# EAGLE design synth-zodiac-taurus-cowbell (EAGLE 9.6.2)
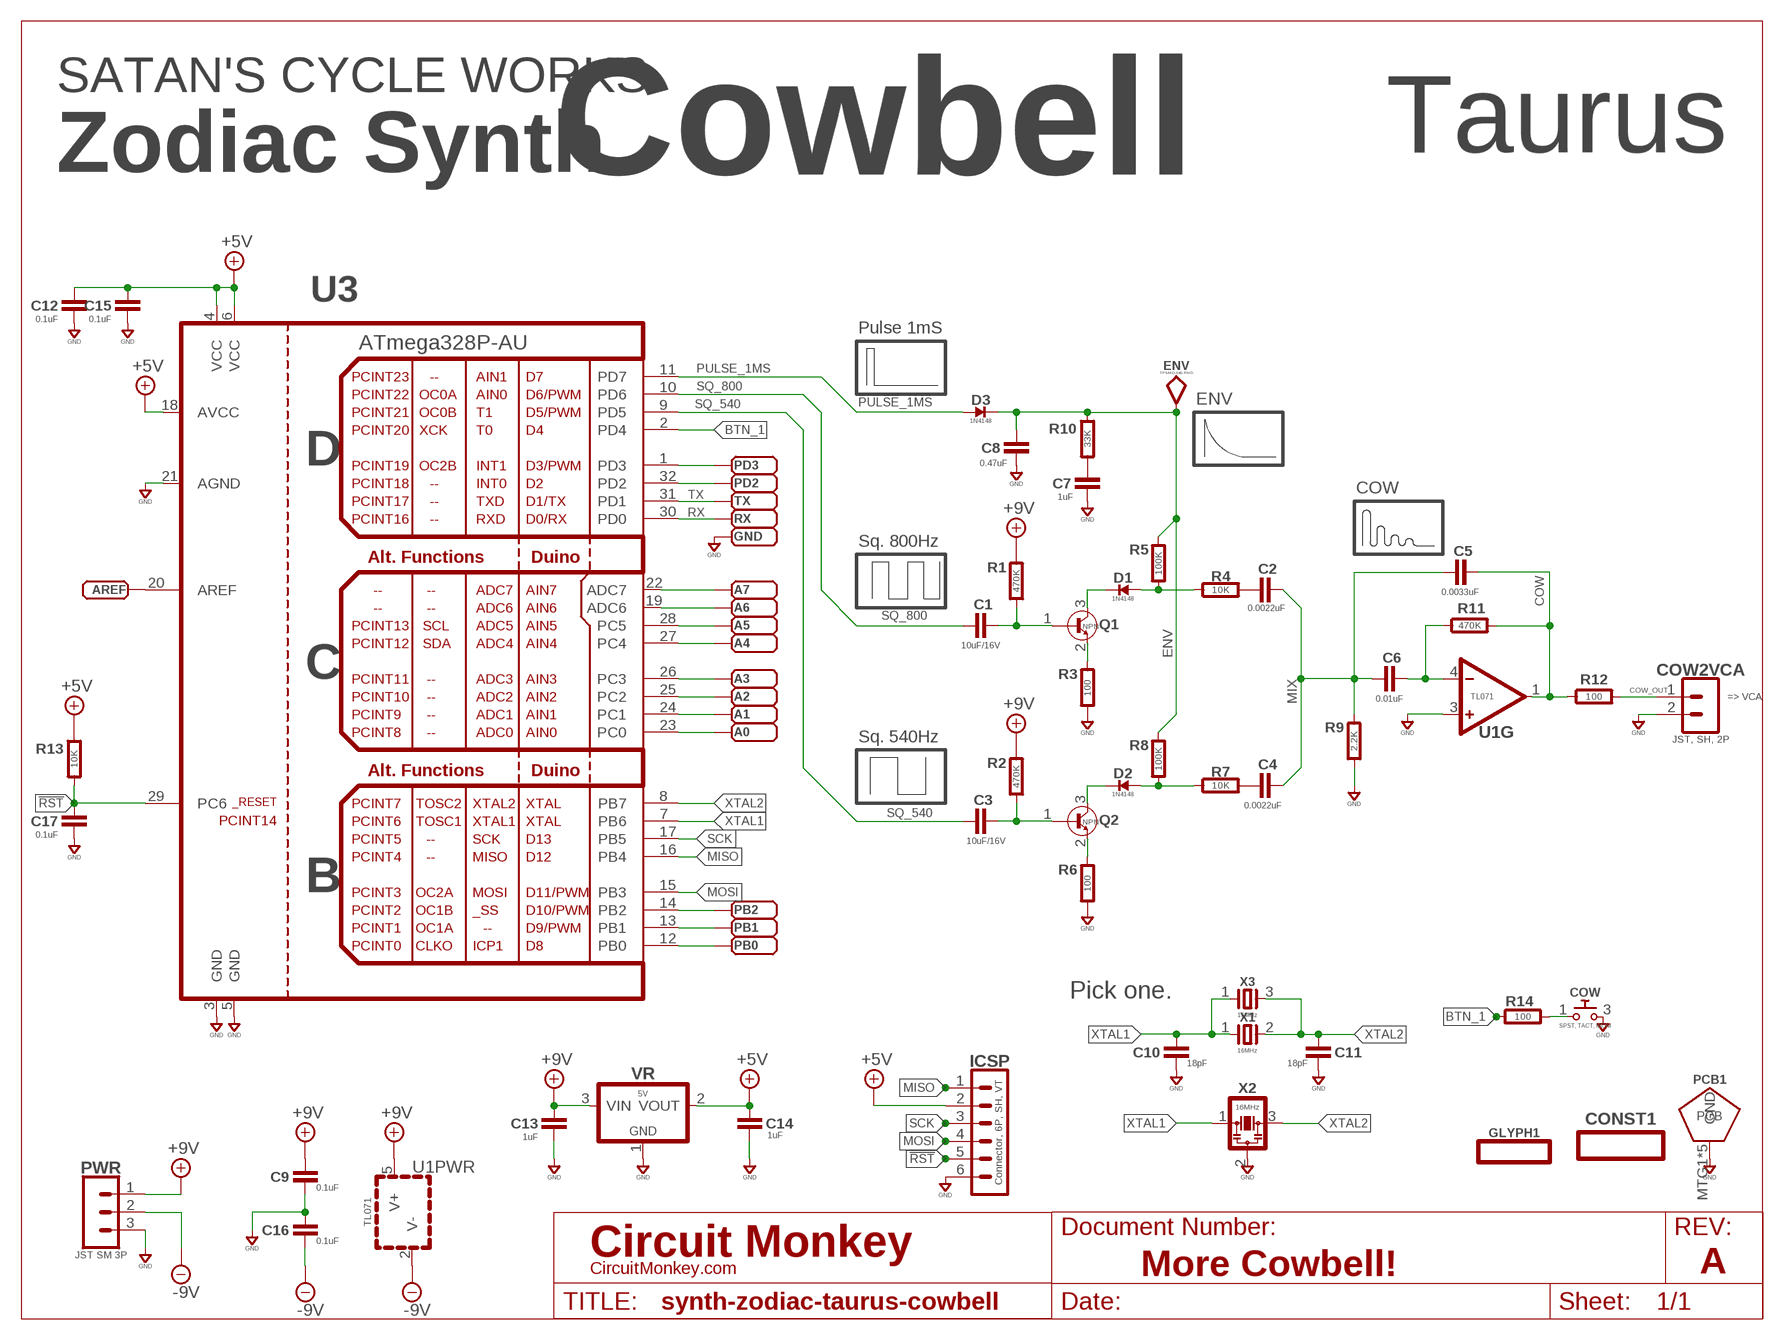
[diagram p0: schematic, sheet 1]
SHEET5 (LETTER_L-CIRCUITMONKEY): DOCUMENT_NUMBER: More Cowbell!; REV: A

## Parts
A0  PADSMD-050X050  [SMD-050X050]
A1  PADSMD-050X050  [SMD-050X050]
A2  PADSMD-050X050  [SMD-050X050]
A3  PADSMD-050X050  [SMD-050X050]
A4  PADSMD-050X050  [SMD-050X050]
A5  PADSMD-050X050  [SMD-050X050]
A6  PADSMD-050X050  [SMD-050X050]
A7  PADSMD-050X050  [SMD-050X050]
AREF  PADSMD-050X050  [SMD-050X050]
C1  10uF/16V  CAPACITOR0603  [0603-CAP]
C2  0.0022uF  CAPACITOR0603  [0603-CAP]
C3  10uF/16V  CAPACITOR0603  [0603-CAP]
C4  0.0022uF  CAPACITOR0603  [0603-CAP]
C5  0.0033uF  CAPACITOR0603  [0603-CAP]
C6  0.01uF  CAPACITOR0603  [0603-CAP]
C7  1uF  CAPACITOR0603  [0603-CAP]
C8  0.47uF  CAPACITOR0603  [0603-CAP]
C9  0.1uF  CAPACITOR0603  [0603-CAP]
C10  18pF  CAPACITOR0603  [0603-CAP]
C11  18pF  CAPACITOR0603  [0603-CAP]
C12  0.1uF  CAPACITOR0603  [0603-CAP]
C13  1uF  CAPACITOR0603  [0603-CAP]
C14  1uF  CAPACITOR0603  [0603-CAP]
C15  0.1uF  CAPACITOR0603  [0603-CAP]
C16  0.1uF  CAPACITOR0603  [0603-CAP]
C17  0.1uF  CAPACITOR0603  [0603-CAP]
CONST1  CONSTELLATION-TAURUS  [TAURUS-CONST]
COW  SPST, TACT, MOM  PUSHBTN-MOMB3FS-BLIND  [B3FS-BACKMOUNT]
COW2VCA  JST, SH, 2P  02P-SM-VT-SMT  [BM02B-SRSS-TB]
D1  1N4148  DIODE-1N4148  [SOD-123]
D2  1N4148  DIODE-1N4148  [SOD-123]
D3  1N4148  DIODE-1N4148  [SOD-123]
ENV  TPSMD-040-RND  [SMD-040MIL-RND]
GLYPH1  GLYPH-TAURUS  [TAURUS-GLYPH]
GND  PADSMD-050X050  [SMD-050X050]
ICSP  Connector, 6P, SH, VT  06P-SM-VT-SMT  [BM06B-SRSS-TB]
PB0  PADSMD-050X050  [SMD-050X050]
PB1  PADSMD-050X050  [SMD-050X050]
PB2  PADSMD-050X050  [SMD-050X050]
PCB1  PCB FAB  PENTAGON-40R  [PENTAGON-40MM-RAD]
PD2  PADSMD-050X050  [SMD-050X050]
PD3  PADSMD-050X050  [SMD-050X050]
PWR  JST SM 3P  03P-SM-VT-SMT  [BM03B-SRSS-TB]
Q1  NPN  NPN-BC846  [SOT-23]
Q2  NPN  NPN-BC846  [SOT-23]
R1  470K  RESISTOR0603  [0603-RES]
R2  470K  RESISTOR0603  [0603-RES]
R3  100  RESISTOR0603  [0603-RES]
R4  10K  RESISTOR0603  [0603-RES]
R5  100K  RESISTOR0603  [0603-RES]
R6  100  RESISTOR0603  [0603-RES]
R7  10K  RESISTOR0603  [0603-RES]
R8  100K  RESISTOR0603  [0603-RES]
R9  2.2K  RESISTOR0603  [0603-RES]
R10  33K  RESISTOR0603  [0603-RES]
R11  470K  RESISTOR0603  [0603-RES]
R12  100  RESISTOR0603  [0603-RES]
R13  10K  RESISTOR0603  [0603-RES]
R14  100  RESISTOR0603  [0603-RES]
RX  PADSMD-050X050  [SMD-050X050]
TX  PADSMD-050X050  [SMD-050X050]
U1  TL071  SINGLE-TL071  [SOT-23-5]
U3  ATmega328P-AU  ATMEGA328AU  [TQFP-32-08]
VR  5V  LDO-3P--5V-SOT23  [SOT-23]
X1  16MHz  2PCTS_445  [CTS_5X3]
X2  16MHz  RESONATOR-CSTE16  [CSTE-RESONATOR]
X3  16MHz  2P3.2X2.5  [32X25]

## Nets
!RST: C17.1 ICSP.5 R13.2 U3.29(PC6)
+5V: C12.1 C14.1 C15.1 ICSP.2 R13.1 U3.4(VCC) U3.6(VCC) U3.18(AVCC) VR.2(VOUT)
+9V: C9.1 C13.1 PWR.1 R1.2 R2.2 U1.5(PWR:V+) VR.3(VIN)
-9V: C16.2 PWR.2 U1.2(PWR:V-)
BTN_1: R14.1 U3.2(PD4)
COW: C5.2 R11.2 R12.1 U1.1(G:OUT)
COW_OUT: COW2VCA.1 R12.2
ENV: C8.1 D3.K ENV.TP R5.2 R8.2 R10.1
GND: C7.2 C8.2 C9.2 C10.2 C11.2 C12.2 C13.2 C14.2 C15.2 C16.1 C17.2 COW2VCA.2 COW.3 GND.1(PAD) ICSP.6 PCB1.MTG1(GND) PCB1.MTG2(GND) PCB1.MTG3(GND) PCB1.MTG4(GND) PCB1.MTG5(GND) PWR.3 R3.1 R6.1 R9.1 U1.3(G:+) U3.3(GND) U3.5(GND) U3.21(AGND) VR.1(GND) X2.2
MISO: ICSP.1 U3.16(PB4)
MIX: C2.2 C4.2 C5.1 C6.1 R9.2
MOSI: ICSP.4 U3.15(PB3)
N$1: D1.K Q1.3(COLLECTOR)
N$2: Q1.2(EMITTER) R3.2
N$3: C1.2 Q1.1(BASE) R1.1
N$4: D1.A R4.1 R5.1
N$5: C2.1 R4.2
N$6: D2.K Q2.3(COLLECTOR)
N$7: Q2.2(EMITTER) R6.2
N$8: C3.2 Q2.1(BASE) R2.1
N$9: D2.A R7.1 R8.1
N$10: C4.1 R7.2
N$11: COW.1 R14.2
N$12: PD3.1(PAD) U3.1(PD3)
N$13: C6.2 R11.1 U1.4(G:-)
N$14: PD2.1(PAD) U3.32(PD2)
N$15: C7.1 R10.2
N$16: PB2.1(PAD) U3.14(PB2)
N$17: PB1.1(PAD) U3.13(PB1)
N$18: PB0.1(PAD) U3.12(PB0)
N$19: A0.1(PAD) U3.23(PC0)
N$20: A1.1(PAD) U3.24(PC1)
N$21: A2.1(PAD) U3.25(PC2)
N$22: A3.1(PAD) U3.26(PC3)
N$23: A4.1(PAD) U3.27(PC4)
N$24: A5.1(PAD) U3.28(PC5)
N$25: A6.1(PAD) U3.19(ADC6)
N$26: A7.1(PAD) U3.22(ADC7)
N$27: AREF.1(PAD) U3.20(AREF)
PULSE_1MS: D3.A U3.11(PD7)
RX: RX.1(PAD) U3.30(PD0)
SCK: ICSP.3 U3.17(PB5)
SQ_540: C3.1 U3.9(PD5)
SQ_800: C1.1 U3.10(PD6)
TX: TX.1(PAD) U3.31(PD1)
XTAL1: C10.1 U3.7(PB6) X1.1 X2.1 X3.1
XTAL2: C11.1 U3.8(PB7) X1.2 X2.3 X3.3

## Notes on the sheet
- Cowbell | Taurus
- SATAN'S CYCLE WORKS
- Zodiac Synth
- Pulse 1mS
- ENV
- COW
- Sq. 800Hz
- => VCA
- Sq. 540Hz
- Pick one.

## Library data of the parts
A0 A1-A7 AREF GND PB0 PB1 PB2 PD2 PD3 RX TX = con-testpoints:PAD: Solder Pad
C1-C17 = rlc:CAPACITOR: Capacitor; COST01: 0.12; COST10: 0.09; COST100: 0.05
CONST1 = circuit-monkey-zodiac:CONSTELLATION: Constellations
COW = switch-smd:PUSHBTN-MOM: Pushbutton Switch; COST01: 0.15; COST10: 0.12; COST100: 0.09; MFR: CK; MPN: B3FS; MPN2: Tayda A-3961(2.3mm), A-5134(3.14mm,RA)
COW2VCA = con-jst:02P: 2 pin connector; COST01: 0.45; COST10: 0.4; COST100: 0.35; MFR: JST; MPN: BMB02B-SRSS-TB
D1-D3 = diodes:DIODE-: Diode; COST01: 0.20; COST10: 0.18; COST100: 0.10; MPN: 1N4148W
ENV = con-testpoints:TP: Test Point -- Testpoint
GLYPH1 = circuit-monkey-zodiac:GLYPH: Glyph
ICSP = con-jst:06P: Connector, 6P; COST01: 0.60; COST10: 0.52; COST100: 0.49; MFR: JST; MPN: BM06-SRSS-TB; VALUE: Connector, 6P, SM, VT
PCB1 = circuit-monkey-zodiac:PENTAGON: Pentagram shaped PCB
PWR = con-jst:03P: 3 pin connector; COST01: 0.60; COST10: 0.45; COST100: 0.38; MFR: JST; MPN: BM03B-SRSS-TB
Q1 Q2 = transistor-bjt:NPN: NPN BJ Transistor; COST01: 0.20; COST10: 0.16; COST100: 0.10; MFR: On Semiconductor; MOUSER: https://www.mouser.com/ProductDetail/ON-Semiconductor/BC846BLT1G; MPN: BC846
R1-R14 = rlc:RESISTOR: Resistor; COST01: 0.10; COST10: 0.05; COST100: 0.02
U1 = op-amp:SINGLE: Single channel Op-amp; COST01: 0.46; COST10: 0.37; COST100: 0.29; MFR: TI; MPN: TL071HIDBV
U3 = atmel-atmega:ATMEGA328: Atmega 328P; MFR: Atmel; MPN: ATMEGA328P-AU; OC_MOUSER: 556-ATMEGA328P-AU; OC_SEEED: 310010049
VR = regulators:LDO-3P-: regulator 3-pin; COST01: 0.66; COST10: 0.56; COST100: 0.39; MFR: Diodes, Inc.; MPN: AP7387-50SA
X1 = xtal:2P: Crystal; COST01: 0.65; COST10: 0.55; COST100: 0.45; MFR: CTS; MPN: 445C35K16M0000
X2 = xtal:RESONATOR: Resonator; COST01: 0.35; COST10: 0.30; COST100: 0.27; MFR: Murata; MPN: CSTCE16M
X3 = xtal:2P: Crystal; MFR: Epson; MPN: FA-238 16.0000MB-K3

## Board
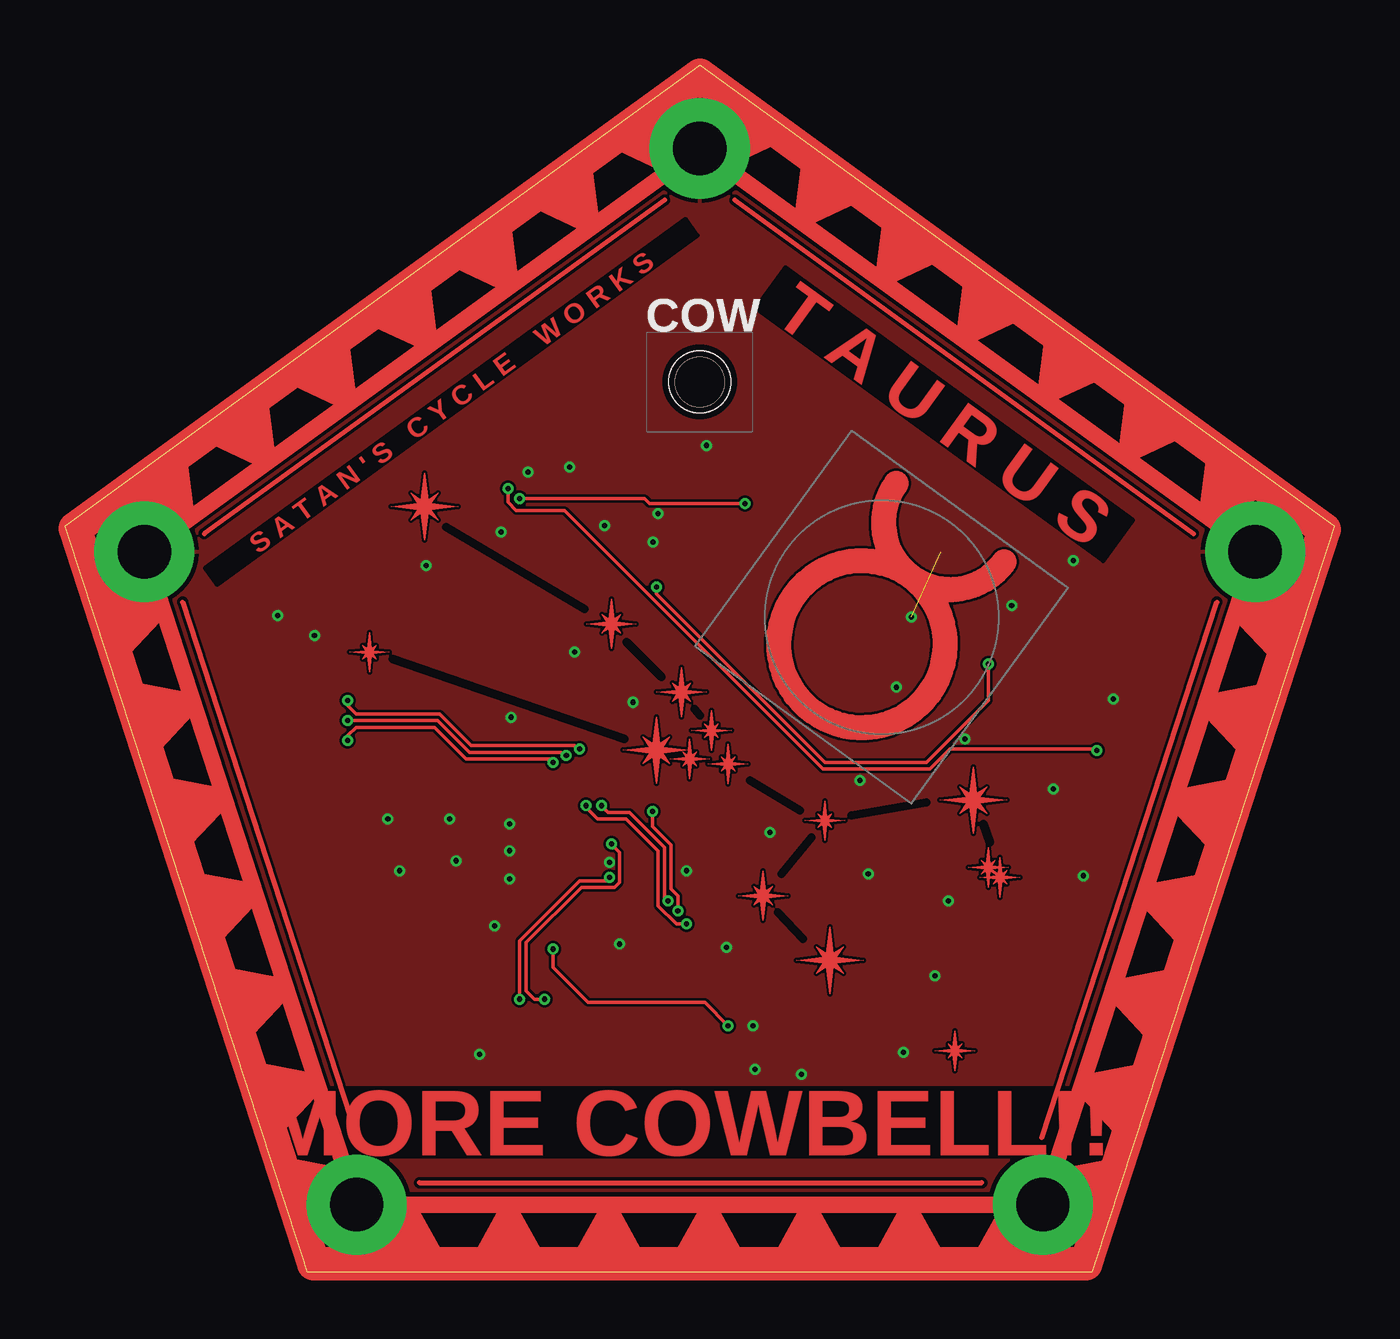
[diagram p1: board, top side]
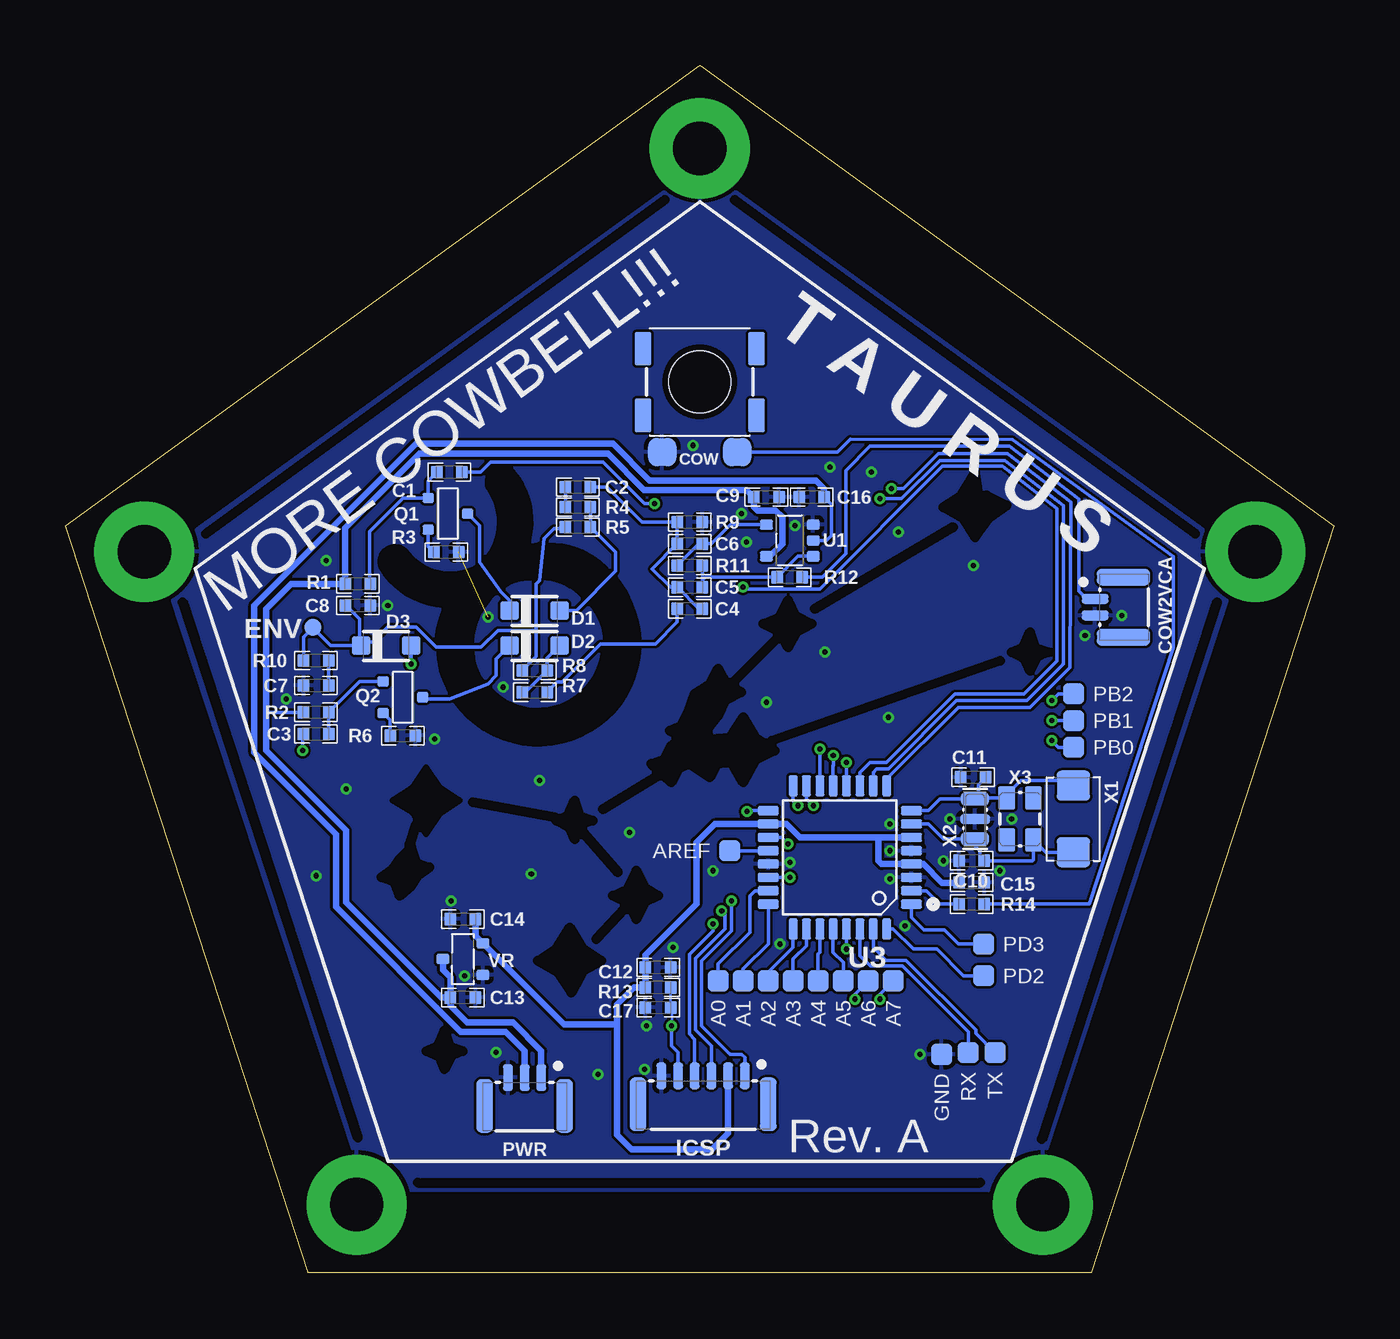
[diagram p2: board, bottom side, seen from below]

Size 76.08 x 72.36 mm. Coordinates in mm from the lower left corner, seen from the top.
Copper layers (1*16): Top 0.0356mm / dielectric 1.5011mm / Bottom 0.0356mm
Design rules "OSH-CircuitMonkey *": minimum track width 6mil, minimum drill 12mil, track to track 6mil, track to pad 6mil, pad to pad 6mil, via to via 6mil, smd to smd 6mil, copper to edge 15mil, drill to drill 6mil, minimum pad ring 7mil, minimum via ring 7mil, stop-mask expansion 3mil, vias tented up to drill 12mil, thermal gap 10mil
bRestrict: area 52.4,26.3 to 56.4,30.3; area 54.2,22.6 to 57.1,25.5; area 44.4,26 to 46.6,28.3; area 40.5,21.2 to 43.2,24.1; area 43.9,16.8 to 47.7,20.7; area 33.5,29.4 to 40.9,36.2; area 31.3,37.5 to 34.2,40.3; area 19.6,44.1 to 23.4,47.9; area 17.1,36.1 to 19.3,38.4; area 52.2,12.2 to 54.4,14.5; 8 lines

### Footprints (pad centres in the part's own frame; a part is rotated, then mirrored left to right if it is on the bottom)
SMD-050X050 = smd 1.27 x 1.27: 1 0.508,0
0603-CAP = smd 0.711 x 0.762: 1 -0.752,0; 2 0.752,0
B3FS-BACKMOUNT = smd 1.7 x 1.7 bottom: 1 4.2,-2.25; 3 4.2,2.25 | smd 2 x 1 bottom: MT1 -2,3.4; MT2 2,3.4; MT3 -2,-3.4; MT4 2,-3.4 | hole 3.7: 0,0
BM02B-SRSS-TB = smd 0.6 x 1.6: 1 -0.5,-0.3; 2 0.5,-0.3 | smd 1 x 3.2: MTG1 1.8,1.4; MTG2 -1.8,1.4
SOD-123 = smd 1.1 x 1.1: A 1.5,0; K -1.5,0
SMD-040MIL-RND = smd 1.016 x 1.016: TP 0,0
BM06B-SRSS-TB = smd 0.6 x 1.6: 1 -2.5,-0.3; 2 -1.5,-0.3; 3 -0.5,-0.3; 4 0.5,-0.3; 5 1.5,-0.3; 6 2.5,-0.3 | smd 1 x 3.2: MTG1 3.9,1.4; MTG2 -3.9,1.4
PENTAGON-40MM-RAD = drill 3.2 pad 6: MTG1 0,35; MTG2 33.3,10.82; MTG3 20.57,-28.32; MTG4 -20.57,-28.32; MTG5 -33.3,10.82
BM03B-SRSS-TB = smd 0.6 x 1.6: 1 -1,-0.3; 2 0,-0.3; 3 1,-0.3 | smd 1 x 3.2: MTG1 2.4,1.4; MTG2 -2.4,1.4
SOT-23 = smd 0.6 x 0.7: 1 -0.95,-1.18; 2 0.95,-1.18; 3 0,1.18
0603-RES = smd 0.711 x 0.762: 1 -0.752,0; 2 0.752,0
SOT-23-5 = smd 0.6 x 0.8: 1 -0.95,-1.4; 2 0,-1.4; 3 0.95,-1.4; 4 0.95,1.4; 5 -0.95,1.4
TQFP-32-08 = smd 1.27 x 0.559: 1 -4.293,2.8; 2 -4.293,2; 3 -4.293,1.2; 4 -4.293,0.4; 5 -4.293,-0.4; 6 -4.293,-1.2; 7 -4.293,-2; 8 -4.293,-2.8; 17 4.293,-2.8; 18 4.293,-2; 19 4.293,-1.2; 20 4.293,-0.4; 21 4.293,0.4; 22 4.293,1.2; 23 4.293,2; 24 4.293,2.8 | smd 0.559 x 1.27: 9 -2.8,-4.293; 10 -2,-4.293; 11 -1.2,-4.293; 12 -0.4,-4.293; 13 0.4,-4.293; 14 1.2,-4.293; 15 2,-4.293; 16 2.8,-4.293; 25 2.8,4.293; 26 2,4.293; 27 1.2,4.293; 28 0.4,4.293; 29 -0.4,4.293; 30 -1.2,4.293; 31 -2,4.293; 32 -2.8,4.293
SOT-23' = smd 0.6 x 0.8: 1 0.95,1.2; 2 -0.95,1.2; 3 0,-1.2
CTS_5X3 = smd 1.8 x 2: 1 -2,0; 2 2,0
CSTE-RESONATOR = smd 0.8 x 1.7: 1 -1.2,0; 3 1.2,0 | smd 0.6 x 1.8: 2 0,0
32X25 = smd 1.4 x 1: 1 -1.25,-0.8; 2 1.25,-0.8; 3 1.25,0.8; 4 -1.25,0.8

### Placement (x,y rotation side)
A0  36.94,17.96 270 bottom
A1  35.44,17.96 270 bottom
A2  33.94,17.96 270 bottom
A3  32.44,17.96 270 bottom
A4  30.94,17.96 270 bottom
A5  29.44,17.96 270 bottom
A6  27.94,17.96 270 bottom
A7  26.44,17.96 270 bottom
AREF  35.74,25.26 180 bottom
C1  53.04,47.96 180 bottom
C2  45.34,47.06 0 bottom
C3  61.04,32.26 0 bottom
C4  38.64,39.76 0 bottom
C5  38.64,41.06 0 bottom
C6  38.64,43.66 0 bottom
C7  61.04,35.16 180 bottom
C8  58.54,39.96 0 bottom
C9  34.04,46.46 0 bottom
C10  21.74,24.66 180 bottom
C11  21.64,29.66 180 bottom
C12  40.54,18.26 0 bottom
C13  52.24,16.46 0 bottom
C14  52.24,21.16 180 bottom
C15  21.74,23.36 0 bottom
C16  31.34,46.46 0 bottom
C17  40.54,15.86 180 bottom
CONST1  38.04,30.36 0 top
COW  38.04,53.36 270 top
COW2VCA  14.04,39.86 270 bottom
D1  47.94,39.66 0 bottom
D2  47.94,37.56 0 bottom
D3  56.84,37.56 0 bottom
ENV  61.24,38.64 0 bottom
GLYPH1  48.94,39.26 324 top
GND  23.54,13.56 270 bottom
ICSP  37.84,11.46 180 bottom
PB0  16.14,31.46 0 bottom
PB1  16.14,33.06 0 bottom
PB2  16.14,34.66 0 bottom
PCB1  38.04,32.36 0 top
PD2  21.54,17.76 0 bottom
PD3  21.54,19.66 0 bottom
PWR  48.54,11.36 180 bottom
Q1  53.14,45.46 270 bottom
Q2  55.84,34.46 270 bottom
R1  58.54,41.26 180 bottom
R2  61.04,33.56 180 bottom
R3  53.24,43.16 180 bottom
R4  45.34,45.86 180 bottom
R5  45.34,44.66 180 bottom
R6  55.84,32.16 180 bottom
R7  47.94,34.76 0 bottom
R8  47.94,36.06 180 bottom
R9  38.64,44.96 180 bottom
R10  61.04,36.66 0 bottom
R11  38.64,42.36 0 bottom
R12  32.64,41.66 0 bottom
R13  40.54,17.06 0 bottom
R14  21.74,22.06 0 bottom
RX  21.94,13.66 270 bottom
TX  20.34,13.66 270 bottom
U1  32.64,43.86 90 bottom
U3  29.64,24.86 180 bottom
VR  5V  [SOT-23']  52.24,18.76 270 bottom
X1  15.64,27.16 90 bottom
X2  21.54,27.16 90 bottom
X3  18.84,27.16 90 bottom

### Tracks (layer width: path | path; a pad name or v marks a point on that pad's centre or on a via)
!RST  (via drill 0.3)
  Top 0.2: v29.24,19.36 29.24,18.26 31.34,16.16 38.34,16.16 v39.74,14.76
  Bottom 0.152: R13.2 C17.1 39.69,15.76 39.69,14.81 v39.74,14.76
  Bottom 0.2: U3.29 v29.24,19.36 | ICSP.5 39.34,13.16 39.74,13.56 v39.74,14.76
+5V
  Bottom 0.4: C14.1 51.49,20.16 VR.2 46.19,14.86 43.09,14.86 42.99,14.96 | 42.99,14.96 42.99,16.06 41.99,17.06 R13.1 C12.1 41.29,19.01 38.24,22.06 38.24,25.76 37.14,26.86 U3.18 32.84,26.86 32.04,26.06 27.34,26.06 | 42.99,14.96 42.99,8.21 42.14,7.36 37.3,7.36 36.34,8.32 ICSP.2 | C15.1 22.52,23.34 23.52,23.34 24.64,24.46 U3.4 27.14,24.46 27.34,24.66 27.34,26.06 | U3.6 27.34,26.06
+9V
  Bottom 0.2: R2.2 64.04,33.56
  Bottom 0.4: VR.3 53.44,18.11 52.99,17.66 C13.1 | PWR.1 47.54,13.26 49.24,14.96 51.99,14.96 52.99,15.96 C13.1 | U1.5 33.84,42.91 33.09,43.66 33.09,45.26 33.49,45.66 34.59,45.66 34.79,45.86 C9.1 35.23,46.89 41.38,46.89 43.54,49.06 54.84,49.06 59.29,44.61 R1.2 62.54,41.26 64.04,39.76 64.04,33.56 64.04,31.26 59.24,26.46 59.24,22.16 53.54,16.46 C13.1
-9V
  Bottom 0.2: U1.2 30.44,43.86 30.14,44.16 30.14,46.01 C16.2
  Bottom 0.4: PWR.2 48.54,13.26 49.69,14.41 52.37,14.41 59.84,21.88 59.84,26.24 64.74,31.14 64.74,39.96 55.04,49.66 43.24,49.66 41.04,47.46 31.09,47.46 30.59,46.96 C16.2
BTN_1
  Bottom 0.2: U3.2 24.44,22.86 23.64,22.06 R14.1
COW
  Bottom 0.2: U1.1 32.14,42.91 R12.1 37.69,41.66 37.87,41.48 37.89,41.51 C5.2 R11.2
COW_OUT
  Bottom 0.2: R12.2 30.69,41.66 29.29,43.06 29.29,48.06 27.84,49.51 19.47,49.51 15.31,46.34 15.31,40.83 14.84,40.36 COW2VCA.1
ENV
  Bottom 0.2: R5.2 46.09,44.56 46.79,44.56 47.39,43.96 47.64,41.46 47.84,41.26 47.84,38.46 | 47.84,38.46 50.14,38.46 51.14,37.46 53.84,37.46 55.04,38.66 56.74,38.66 57.64,37.76 58.34,37.76 | C8.1 59.24,39.96 58.44,39.16 58.44,37.76 58.34,37.76 | 58.34,37.76 D3.K 60.16,37.56 ENV.TP 61.24,38.61 61.79,38.06 R10.1 | 47.84,38.46 47.84,36.91 R8.2
GND  (via drill 0.3)  (1 unrouted)
  other vias: 32.34,44.76 19.34,27.16 23.04,27.16 23.44,24.66 26.64,23.56 26.64,25.26 26.64,26.86 32.64,24.56 41.24,14.76 41.34,12.16 44.14,11.86 12.74,39.36 14.94,38.16 35.54,45.46 49.84,35.06 50.74,39.26 56.74,39.96 62.84,34.36 52.94,22.26 52.14,17.76 50.24,13.16 35.24,43.76 37.24,24.06 39.64,19.46 33.24,19.66 25.74,20.76 20.04,24.06 24.84,13.06 47.64,29.46 42.24,26.36 48.14,23.86 34.04,34.16 30.54,37.16 26.74,33.26 21.64,42.36 38.44,49.56 30.24,48.26 27.74,47.96 26.14,44.36 53.94,31.96 59.24,28.96 60.44,42.66 61.04,23.76
  pour Top (rank 5): 18.04,4.86 58.04,4.86 70.54,42.86 38.04,66.36 5.54,42.86
  pour Bottom (rank 5): 18.04,4.86 58.04,4.86 70.54,42.86 38.04,66.36 5.54,42.86
MISO  (via drill 0.3)
  Top 0.2: v36.14,22.26 35.94,22.46 35.94,25.46 33.84,27.56 32.54,27.56 v32.14,27.96
  Bottom 0.2: v32.14,27.96 v32.15,27.96 32.44,28.25 U3.16 | v36.14,22.26 36.14,20.46 37.94,18.66 37.94,14.76 36.24,13.06 35.54,13.06 35.34,12.86 ICSP.1
MIX
  Bottom 0.2: C2.2 43.59,47.06 41.49,44.96 R9.2 C6.1 40.89,42.16 39.79,41.06 C5.1 38.09,39.76 C4.2
MOSI  (via drill 0.3)
  Top 0.2: v37.24,20.86 36.64,20.86 35.54,21.96 35.54,25.26 33.62,27.18 31.9,27.18 31.23,27.85 v31.23,27.96
  Bottom 0.2: U3.15 31.64,28.35 31.25,27.96 v31.23,27.96 | ICSP.4 38.34,13.96 38.65,14.27 38.65,19.06 37.24,20.46 v37.24,20.86
N$1
  Bottom 0.2: Q1.3 51.24,44.74 51.24,42.56 49.94,40.76 49.44,40.26 D1.K
N$2
  Bottom 0.2: R3.2 54.32,43.49 Q1.2
N$3
  Bottom 0.2: R1.1 57.84,41.31 57.84,44.39 55.82,46.41 Q1.1 54.34,46.43 54.34,47.41 C1.2
N$4
  Bottom 0.2: R4.1 R5.1 43.09,43.16 43.09,42.01 45.44,39.66 D1.A
N$5
  Bottom 0.2: C2.1 R4.2
N$6
  Bottom 0.2: Q2.3 54.54,34.46 54.44,34.36 53.04,34.36 50.74,35.26 50.24,35.76 50.24,36.76 D2.K
N$7
  Bottom 0.2: R6.2 56.59,33.08 Q2.2
N$8
  Bottom 0.2: Q2.1 58.44,35.41 R2.1 C3.2
N$9
  Bottom 0.2: R7.1 48.49,34.76 R8.1 47.19,36.81 D2.A
N$10
  Bottom 0.2: R7.2 46.59,35.36 46.29,35.36 43.99,37.66 40.69,37.66 39.39,38.96 C4.1
N$11
  Bottom 0.2: R14.2 14.68,22.06 9.64,37.45 9.64,42.91 19.29,49.91 29.02,49.93 29.79,49.16 COW.1
N$12
  Bottom 0.2: U3.1 25.35,21.27 24.59,20.51 23.39,20.51 22.54,19.66 PD3.1
N$13
  Bottom 0.2: U1.4 36.19,44.81 37.34,43.66 C6.2 38.09,43.66 R11.1
N$14
  Bottom 0.2: PD2.1 22.23,17.76 23.83,19.36 25.24,19.36 26.45,20.57 U3.32
N$15
  Bottom 0.2: R10.2 C7.1
N$16  (via drill 0.3)
  Top 0.2: v30.84,31.36 30.74,31.36 30.54,31.56 24.33,31.56 22.43,33.46 17.43,33.46 16.93,33.96 v16.93,34.26
  Bottom 0.2: U3.14 v30.84,31.36 | v16.93,34.26 16.53,34.66 PB2.1
N$17  (via drill 0.3)
  Top 0.2: v30.04,30.96 29.94,30.96 29.74,31.16 24.23,31.16 22.33,33.06 v16.93,33.06
  Bottom 0.2: U3.13 30.04,30.36 v30.04,30.96 | v16.93,33.06 PB1.1
N$18  (via drill 0.3)
  Top 0.2: v29.24,30.56 29.04,30.76 24.04,30.76 22.14,32.66 17.44,32.66 16.94,32.16 v16.94,31.86
  Bottom 0.2: v16.94,31.86 16.54,31.46 PB0.1 | v29.24,30.56 U3.12
N$19
  Bottom 0.2: U3.23 34.74,22.86 35.04,22.56 35.04,20.36 36.94,18.46 A0.1
N$20
  Bottom 0.2: U3.24 33.94,19.67 35.44,18.16 A1.1
N$21
  Bottom 0.2: U3.25 32.44,19.46 33.94,17.96 A2.1
N$22
  Bottom 0.2: U3.26 31.64,19.56 32.44,18.76 A3.1
N$23
  Bottom 0.2: U3.27 30.84,19.16 30.94,19.06 A4.1
N$24
  Bottom 0.2: U3.28 30.04,19.16 29.44,18.56 A5.1
N$25  (via drill 0.3)
  Top 0.2: v28.74,16.36 28.14,16.36 27.64,16.86 27.64,19.76 30.94,23.06 32.94,23.06 33.24,23.36 33.24,25.16 v32.74,25.66
  Bottom 0.2: A6.1 28.74,16.65 v28.74,16.36 | U3.19 33.14,26.06 v32.74,25.67 v32.74,25.66
N$26  (via drill 0.3)
  Top 0.2: v27.24,16.36 27.24,19.86 30.84,23.46 32.44,23.46 v32.64,23.66
  Bottom 0.2: A7.1 27.24,16.65 v27.24,16.36 | v32.64,23.66 U3.22
N$27
  Bottom 0.2: U3.20 AREF.1
PULSE_1MS  (via drill 0.3)
  Top 0.2: v35.44,41.06 35.44,40.66 45.54,30.56 51.64,30.56 55.34,34.26 v55.34,36.46
  Bottom 0.2: U3.11 28.44,29.95 27.84,30.55 26.84,30.55 22.74,34.66 18.62,34.66 16.64,36.64 16.64,45.78 19.89,48.31 23.49,48.31 30.84,40.96 35.44,40.96 35.49,41.01 v35.44,41.06 | D3.A v55.34,36.46
RX
  Bottom 0.2: U3.30 28.44,18.96 27.82,18.34 25.89,18.34 21.94,14.39 RX.1
SCK  (via drill 0.3)
  Top 0.2: v36.73,21.66 36.73,22.56 36.33,22.96 36.33,25.6 35.2,26.72 v35.2,27.62
  Bottom 0.2: v36.73,21.66 36.52,21.46 36.52,20.58 38.29,18.81 38.29,14.51 37.34,13.56 ICSP.3 | v35.2,27.62 35.17,27.66 U3.17
SQ_540  (via drill 0.3)
  Top 0.2: v26.54,46.96 26.54,46.16 27.04,45.66 29.94,45.66 45.44,30.16 51.84,30.16 53.04,31.36 61.74,31.36 v61.84,31.26
  Bottom 0.2: v26.54,46.96 25.84,46.96 23.74,49.06 19.59,49.06 15.79,46.16 15.84,36.26 18.25,33.85 22.54,33.85 26.84,29.55 U3.9 | v61.84,31.26 61.84,32.21 C3.1
SQ_800  (via drill 0.3)
  Top 0.2: v27.24,46.36 34.74,46.36 35.04,46.06 v40.74,46.06
  Bottom 0.2: U3.10 27.64,29.95 27.44,30.15 26.74,30.15 22.64,34.25 18.44,34.25 16.24,36.46 16.25,45.96 19.74,48.66 23.64,48.66 25.94,46.36 v27.24,46.36 | v40.74,46.06 41.34,46.06 43.84,48.56 50.59,48.56 51.19,47.96 C1.1
TX
  Bottom 0.2: U3.31 27.64,19.46 26.87,18.69 25.68,18.69 21.49,14.51 21.49,14.3 TX.1
XTAL1
  Bottom 0.2: X1.1 17.29,25.16 X3.1 18.04,24.71 18.09,24.66 C10.1 21.24,24.66 21.24,25.26 21.54,25.56 X2.1 23.44,25.96 24.34,26.86 U3.7
XTAL2
  Bottom 0.2: X1.2 15.94,29.46 18.8,29.46 19.64,28.61 X3.3 21.34,28.41 | U3.8 24.34,27.66 23.64,28.36 X2.3 21.49,28.41 21.34,28.41 | C11.1 21.34,29.21 21.34,28.41

### Text on the board
Top: S A T A N ' S C Y C L E W O R K S | T A U R U S | MORE COWBELL!!!
bPlace: T A U R U S | MORE COWBELL!!! | Rev. A
tStop: S A T A N ' S C Y C L E W O R K S | T A U R U S | MORE COWBELL!!!